# EAGLE design KeyboardBreakout (EAGLE 9.1.3)
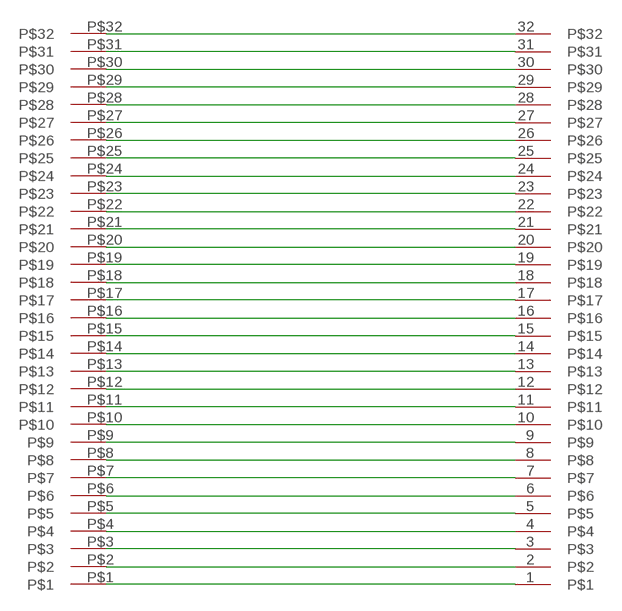
[diagram p0: schematic, sheet 1]

## Parts
U$1  32  [32PIN]
U$2  32THRU  [32PINTHRU]

## Nets
N$1: U$1.P$32 U$2.32
N$2: U$1.P$31 U$2.31
N$3: U$1.P$30 U$2.30
N$4: U$1.P$29 U$2.29
N$5: U$1.P$28 U$2.28
N$6: U$1.P$27 U$2.27
N$7: U$1.P$26 U$2.26
N$8: U$1.P$25 U$2.25
N$9: U$1.P$24 U$2.24
N$10: U$1.P$23 U$2.23
N$11: U$1.P$22 U$2.22
N$12: U$1.P$21 U$2.21
N$13: U$1.P$20 U$2.20
N$14: U$1.P$19 U$2.19
N$15: U$1.P$18 U$2.18
N$16: U$1.P$17 U$2.17
N$17: U$1.P$16 U$2.16
N$18: U$1.P$15 U$2.15
N$19: U$1.P$14 U$2.14
N$20: U$1.P$13 U$2.13
N$21: U$1.P$12 U$2.12
N$22: U$1.P$11 U$2.11
N$23: U$1.P$10 U$2.10
N$24: U$1.P$9 U$2.9
N$25: U$1.P$8 U$2.8
N$26: U$1.P$7 U$2.7
N$27: U$1.P$6 U$2.6
N$28: U$1.P$5 U$2.5
N$29: U$1.P$4 U$2.4
N$30: U$1.P$3 U$2.3
N$31: U$1.P$2 U$2.2
N$32: U$1.P$1 U$2.1

## Library data of the parts
U$1 U$2 = Controller Library:32

## Board
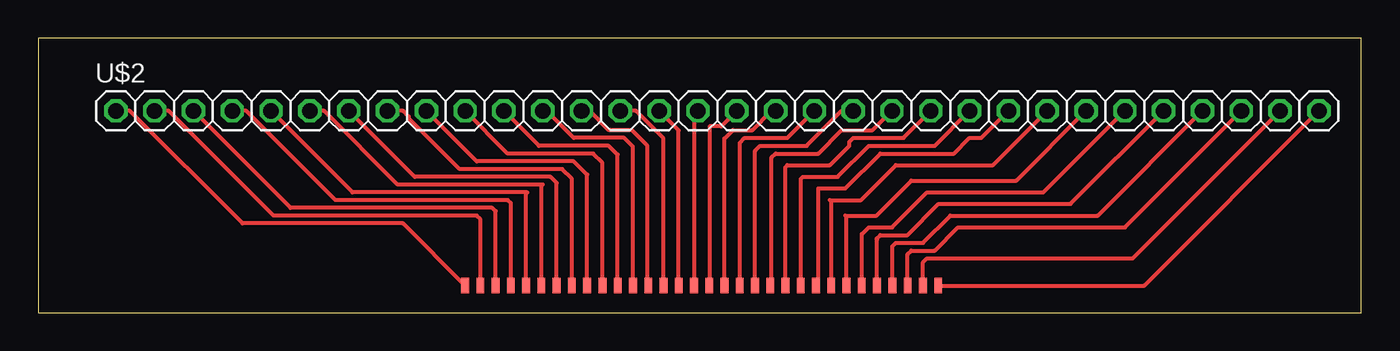
[diagram p1: board, top side]

Size 86.59 x 17.96 mm. Coordinates in mm from the lower left corner, seen from the top.
Outline: 0,0 86.59,0 86.59,17.96 0,17.96 0,0
Copper layers (1*16): Top 0.035mm / dielectric 1.5mm / Bottom 0.035mm
Design rules "default *": minimum track width 6mil, minimum drill 0.35mm, track to track 10mil, track to pad 10mil, pad to pad 6mil, via to via 6mil, smd to smd 6mil, copper to edge 40mil, drill to drill 6mil, minimum pad ring 10mil, minimum via ring 8mil, stop-mask expansion 4mil, vias tented up to drill 0mil, thermal gap 10mil

### Footprints (pad centres in the part's own frame; a part is rotated, then mirrored left to right if it is on the bottom)
32PIN = smd 1.016 x 0.508: P$1 0,0; P$2 0,0.999; P$3 0,1.997; P$4 0,2.996; P$5 0,3.994; P$6 0,4.993; P$7 0,5.991; P$8 0,6.99; P$9 0,7.989; P$10 0,8.987; P$11 0,9.986; P$12 0,10.984; P$13 0,11.983; P$14 0,12.981; P$15 0,13.98; P$16 0,14.979; P$17 0,15.977; P$18 0,16.976; P$19 0,17.974; P$20 0,18.973; P$21 0,19.972; P$22 0,20.97; P$23 0,21.969; P$24 0,22.967; P$25 0,23.966; P$26 0,24.964; P$27 0,25.963; P$28 0,26.962; P$29 0,27.96; P$30 0,28.959; P$31 0,29.957; P$32 0,30.956
32PINTHRU = drill 1.016 octagon: 1 1.27,0; 2 3.81,0; 3 6.35,0; 4 8.89,0; 5 11.43,0; 6 13.97,0; 7 16.51,0; 8 19.05,0; 9 21.59,0; 10 24.13,0; 11 26.67,0; 12 29.21,0; 13 31.75,0; 14 34.29,0; 15 36.83,0; 16 39.37,0; 17 41.91,0; 18 44.45,0; 19 46.99,0; 20 49.53,0; 21 52.07,0; 22 54.61,0; 23 57.15,0; 24 59.69,0; 25 62.23,0; 26 64.77,0; 27 67.31,0; 28 69.85,0; 29 72.39,0; 30 74.93,0; 31 77.47,0; 32 80.01,0

### Placement (x,y rotation side)
U$1  27.94,1.78 270 top
U$2  3.81,13.21 0 top

### Tracks (layer width: path | path; a pad name or v marks a point on that pad's centre or on a via)
N$1
  Top 0.254: U$1.P$32 72.39,1.78 U$2.32
N$2
  Top 0.254: U$1.P$31 57.91,1.79 57.91,3.3 58.17,3.56 71.63,3.56 U$2.31
N$3
  Top 0.254: U$1.P$30 56.9,3.81 57.15,4.06 58.67,4.06 60.2,5.59 71.12,5.59 U$2.30
N$4
  Top 0.254: U$1.P$29 55.9,4.3 55.88,4.32 56.13,4.57 57.91,4.57 59.69,6.35 69.34,6.35 U$2.29
N$5
  Top 0.254: U$1.P$28 54.9,4.79 54.86,4.83 55.12,5.08 56.9,5.08 58.93,7.11 67.56,7.11 U$2.28
N$6
  Top 0.254: U$1.P$27 53.9,5.13 54.36,5.59 55.88,5.59 58.17,7.87 65.79,7.87 U$2.27
N$7
  Top 0.254: U$1.P$26 52.9,6.28 52.83,6.35 54.86,6.35 57.15,8.64 64.01,8.64 U$2.26
N$8
  Top 0.254: U$1.P$25 51.91,7.28 51.82,7.37 53.85,7.37 56.13,9.65 62.48,9.65 U$2.25
N$9
  Top 0.254: U$1.P$24 51.05,1.92 51.05,8.13 52.83,8.13 55.12,10.41 59.94,10.41 60.96,11.43 61.72,11.43 U$2.24
N$10
  Top 0.254: U$1.P$23 49.91,8.76 50.04,8.89 52.32,8.89 54.36,10.92 58.67,10.92 U$2.23
N$11
  Top 0.254: U$1.P$22 48.91,9.54 49.02,9.65 51.82,9.65 53.09,10.92 53.09,11.18 53.34,11.43 56.64,11.43 U$2.22
N$12
  Top 0.254: U$1.P$21 48.01,1.87 48.01,10.16 48.26,10.41 51.05,10.41 52.58,11.94 54.61,11.94 U$2.21
N$13
  Top 0.254: U$1.P$20 46.91,10.59 47.24,10.92 50.29,10.92 52.58,13.21 U$2.20
N$14
  Top 0.254: U$1.P$19 45.91,11.12 46.23,11.43 49.02,11.43 U$2.19
N$15
  Top 0.254: U$1.P$18 44.92,11.39 45.47,11.94 46.74,11.94 48.01,13.21 U$2.18
N$16
  Top 0.254: U$2.17 44.7,12.19 43.94,12.19 43.94,1.8 U$1.P$17
N$17
  Top 0.254: U$2.16 42.92,12.95 U$1.P$16
N$18
  Top 0.254: U$1.P$15 41.92,11.93 U$2.15
N$19
  Top 0.254: U$1.P$14 40.92,11.4 39.12,13.21 U$2.14
N$20
  Top 0.254: U$1.P$13 39.88,1.82 39.88,10.92 38.86,11.94 37.34,11.94 36.07,13.21 U$2.13
N$21
  Top 0.254: U$1.P$12 38.92,10.86 38.35,11.43 35.05,11.43 33.27,13.21 U$2.12
N$22
  Top 0.254: U$1.P$11 37.93,10.33 37.34,10.92 32.77,10.92 U$2.11
N$23
  Top 0.254: U$1.P$10 36.93,9.81 36.32,10.41 30.73,10.41 U$2.10
N$24
  Top 0.254: U$1.P$9 35.93,9.03 35.05,9.91 28.7,9.91 U$2.9
N$25
  Top 0.254: U$1.P$8 34.93,8.76 34.29,9.4 27.59,9.4 24.26,12.74 24.26,12.83 23.88,13.21 U$2.8
N$26
  Top 0.254: U$1.P$7 33.93,8.49 33.53,8.89 24.64,8.89 U$2.7
N$27
  Top 0.254: U$1.P$6 32.93,8.29 33.02,8.38 23.53,8.38 18.7,13.21 U$2.6
N$28
  Top 0.254: U$1.P$5 31.93,7.8 32,7.87 20.57,7.87 U$2.5
N$29
  Top 0.254: U$1.P$4 30.94,7.16 30.73,7.37 19.47,7.37 13.62,13.21 U$2.4
N$30
  Top 0.254: U$1.P$3 29.94,6.64 29.72,6.86 16.51,6.86 U$2.3
N$31
  Top 0.254: U$1.P$2 28.94,6.11 28.7,6.35 15.4,6.35 8.54,13.21 U$2.2
N$32
  Top 0.254: U$1.P$1 23.88,5.84 13.37,5.84 6,13.21 U$2.1